# EasyEDA Pro project 51单片机串口开关V2.eprj

# Schematic Schematic1
Create Date: 2023-08-01; Page Name: P1; Project Name: 51单片机串口开关V2; Schematic Name: Schematic1; Update Date: 2023-11-14; Company: 嘉立创EDA; Page Size: A4; Version: V1.0
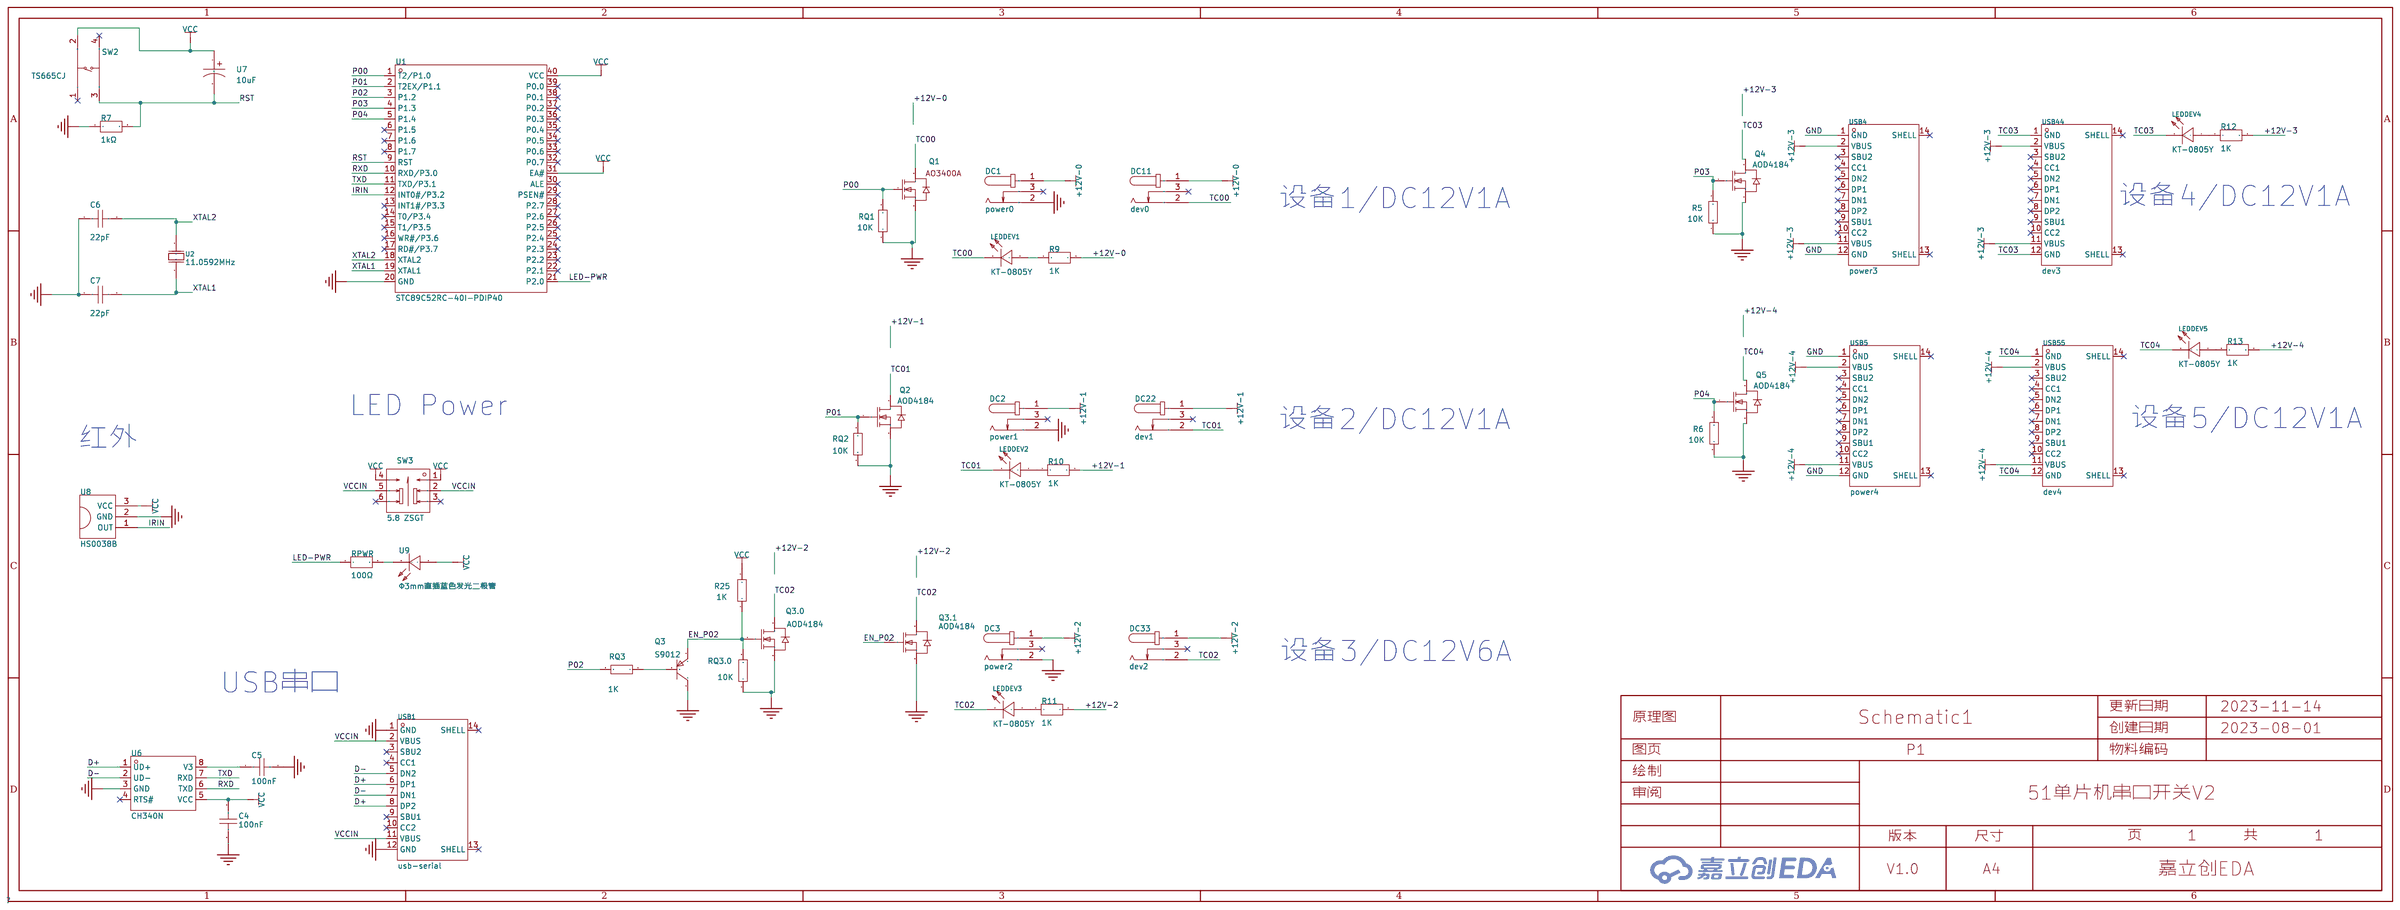
[diagram p0: schematic sheet]

## Parts
C4  100nF  [C0603]
C5  100nF  [C0603]
C6  22pF  [CAP-TH_L5.8-W2.4-P2.54-D0.6]
C7  22pF  [CAP-TH_L5.8-W2.4-P2.54-D0.6]
DC1  power0  [DC-IN-TH_DC-005-20A]
DC2  power1  [DC-IN-TH_DC-005-20A]
DC3  power2  [DC-IN-TH_DC-005-20A]
DC11  dev0  [DC-IN-TH_DC-005-20A]
DC22  dev1  [DC-IN-TH_DC-005-20A]
DC33  dev2  [DC-IN-TH_DC-005-20A]
LEDDEV1  KT-0805Y  [LED0805-R-RD]
LEDDEV2  KT-0805Y  [LED0805-R-RD]
LEDDEV3  KT-0805Y  [LED0805-R-RD]
LEDDEV4  KT-0805Y  [LED0805-R-RD]
LEDDEV5  KT-0805Y  [LED0805-R-RD]
Q1  AO3400A  [SOT-23-3_L2.9-W1.3-P1.90-LS2.4-BR]
Q2  AOD4184  [TO-252-2_L6.6-W6.1-P4.58-LS9.9-BR]
Q3  S9012  [TO-92-3_L4.6-W3.6-P1.27-L-1]
Q3.0  AOD4184  [TO-252-2_L6.6-W6.1-P4.58-LS9.9-BR]
Q3.1  AOD4184  [TO-252-2_L6.6-W6.1-P4.58-LS9.9-BR]
Q4  AOD4184  [TO-252-2_L6.6-W6.1-P4.58-LS9.9-BR]
Q5  AOD4184  [TO-252-2_L6.6-W6.1-P4.58-LS9.9-BR]
R5  10K  [R0603]
R6  10K  [R0603]
R7  1kΩ  [RES-TH_BD2.3-L6.5-P10.50-D0.5]
R9  1K  [RES-TH_BD2.3-L6.5-P10.50-D0.5]
R10  1K  [RES-TH_BD2.3-L6.5-P10.50-D0.5]
R11  1K  [RES-TH_BD2.3-L6.5-P10.50-D0.5]
R12  1K  [RES-TH_BD2.3-L6.5-P10.50-D0.5]
R13  1K  [RES-TH_BD2.3-L6.5-P10.50-D0.5]
R25  1K  [R0603]
RPWR  100Ω  [RES-TH_BD2.3-L6.5-P10.50-D0.5]
RQ1  10K  [R0603]
RQ2  10K  [R0603]
RQ3  1K  [R0603]
RQ3.0  10K  [R0603]
SW2  TS665CJ  [SW-TH_4P-L6.0-W6.0-P4.50-LS6.5]
SW3  5.8 ZSGT  [SW-TH_5.8ZSGT]
U1  STC89C52RC-40I-PDIP40  [DIP-40_L52.0-W13.7-P2.54-LS15.2-BL]
U2  11.0592MHz  [CRYSTAL-TH_L10.8-W4.5-P4.88]
U6  CH340N  [SOP-8_L4.9-W3.9-P1.27-LS6.0-BL]
U7  10uF  [CAP-TH_BD6.3-P2.50-D0.5-FD]
U8  HS0038B  [OPTO-TH_HS0038B-A]
U9  Φ3mm直插蓝色发光二极管  [LED-TH_BD4.1-P2.50-D0.5-FD_BULE]
USB1  usb-serial  [USB-C-SMD_TYPE-C-6PIN-2MD-073]
USB4  power3  [USB-C-SMD_TYPE-C-6PIN-2MD-073]
USB5  power4  [USB-C-SMD_TYPE-C-6PIN-2MD-073]
USB44  dev3  [USB-C-SMD_TYPE-C-6PIN-2MD-073]
USB55  dev4  [USB-C-SMD_TYPE-C-6PIN-2MD-073]

## Library data of the parts
C4 C5 = CAP_0603: Supplier Footprint: 0603
C6 C7 = CC1H220KA1EDCH4B1100: 容值:22pF;精度:±10%;额定电压:50V;温度系数:NP0;; LCSC Part Name: 22pF ±10% 50V; Supplier Part: C2832510; Manufacturer: Dersonic(德尔创); Supplier Footprint: 插件,P=2.54mm; JLCPCB Part Class: 扩展库; Datasheet: https://atta.szlcsc.com/upload/public/pdf/source/20211103/062C09467AB58979163D97626BAD0297.pdf; Supplier: LCSC; Tolerance: ±10%; Voltage Rated: 50V; Lead Spacing: 2.54mm; Temperature Coefficient: NP0; φD: 4.8mm; Body Thickness: 2.4mm
DC1-DC3 DC11 DC22 DC33 = DC-005-20A_C136744: 触点内径:2mm;触点外径:6.4mm;额定电流:500mA;额定电压:30V;; LCSC Part Name: DC-005-20A  内芯2.0mm 全铜; Supplier Part: C136744; Manufacturer: 韩国韩荣; Manufacturer Part: DC-005-20A; Supplier Footprint: 插件; JLCPCB Part Class: 扩展库; Datasheet: https://atta.szlcsc.com/upload/public/pdf/source/20210810/D1FE451D887B1804F0660F580C4AD849.pdf; Supplier: LCSC; Inside Contact Diameter: 2mm; Outside Contact Diameter: 6.4mm; Current Rating (Max): 500mA; Voltage Rating (Max): 30V
LEDDEV1-LEDDEV5 = KT-0805Y: 发光颜色:黄灯;二极管配置:-;透镜颜色:-;主波长:-;色温:-;功率:-;发光角度:-;安装方式:-;工作温度:-;; LCSC Part Name: 0805 黄灯 高亮; Supplier Part: C2296; Manufacturer: KENTO; Supplier Footprint: 0805; JLCPCB Part Class: 基础库; Datasheet: https://atta.szlcsc.com/upload/public/pdf/source/20160421/1461205044170.pdf; Supplier: LCSC; Emitted Color: 黄灯
Q1 = AO3400A_C347475: 类型:N沟道;漏源电压(Vdss):30V;连续漏极电流(Id):5.8A;功率(Pd):1.4W;导通电阻(RDS(on)@Vgs,Id):35mΩ@10V,5.8A;; LCSC Part Name: N沟道 30V 5.8A; Supplier Part: C347475; Manufacturer: UMW(广东友台半导体); Supplier Footprint: SOT-23; JLCPCB Part Class: 扩展库; Datasheet: https://atta.szlcsc.com/upload/public/pdf/source/20220429/98B7D6B2B83615ED4523A0C76368EB06.pdf; Supplier: LCSC; Type: N沟道; Drain Source Voltage (Vdss): 30V; Continuous Drain Current (Id): 5.8A; Power Dissipation (Pd): 1.4W; Drain Source On Resistance (RDS(on)@Vgs,Id): 35mΩ@10V,5.8A; Gate Threshold Voltage (Vgs(th)@Id): 1.4V@250uA; Total Gate Charge (Qg@Vgs): 12nC@4.5V; Input Capacitance (Ciss@Vds): 1.05nF@15V; Operating Temperature: -55℃~+150℃@(Tj)
Q2 Q3.0 Q3.1 Q4 Q5 = AOD4184: 类型:N沟道;漏源电压(Vdss):40V;连续漏极电流(Id):85A;功率(Pd):-;导通电阻(RDS(on)@Vgs,Id):5mΩ@10V,85A;阈值电压(Vgs(th)@Id):-;栅极电荷(Qg@Vgs):-;输入电容(Ciss@Vds):-;反向传输电容(Crss@Vds):-;; LCSC Part Name: N沟道 40V 85A; Supplier Part: C879026; Manufacturer: VBsemi(微碧); Supplier Footprint: TO-252; JLCPCB Part Class: 扩展库; Datasheet: https://atta.szlcsc.com/upload/public/pdf/source/20200930/C879026_1C5ED3CC2E280C7EDEB6515D52B7B7F3.pdf; Supplier: LCSC; Type: N沟道; Drain Source Voltage (Vdss): 40V; Continuous Drain Current (Id): 85A; Drain Source On Resistance (RDS(on)@Vgs,Id): 5mΩ@10V,85A
Q3 = S9012_C2931496: Supplier Part: C2931496; Manufacturer: JSMSEMI(杰盛微); Supplier Footprint: TO-92-3; JLCPCB Part Class: 扩展库; Datasheet: https://atta.szlcsc.com/upload/public/pdf/source/20211216/8B1045EB70E9342E1C247EF466AD93DE.pdf; Supplier: LCSC
R5 R6 R25 RQ1-RQ3 RQ3.0 = Res_0603: Supplier Footprint: 0603
R7 R9-R13 RPWR = MF1/4W-1KΩ±1%T52: 电阻类型:金属膜电阻;阻值:1kΩ;精度:±1%;功率:250mW;温度系数:±200ppm/℃;; LCSC Part Name: 1kΩ ±1% 250mW; Supplier Part: C713997; Manufacturer: 华星机电; Supplier Footprint: 轴向引线; JLCPCB Part Class: 扩展库; Datasheet: https://atta.szlcsc.com/upload/public/pdf/source/20200731/C713882_AE8EB1102749D7E4FB4FB13DC898C429.pdf; Supplier: LCSC; Type: 金属膜电阻; Tolerance: ±1%; Power(Watts): 250mW; Temperature Coefficient: ±200ppm/℃
SW2 = TS665CJ: 触点电流:50mA;额定电压(DC):12V;电路结构:单刀单掷;安装方式:直插;带灯:-;机械寿命:-;; LCSC Part Name: 6*6*5mm 直插 轻触开关; Supplier Part: C393938; Manufacturer: SHOU HAN(首韩); Supplier Footprint: 插件; JLCPCB Part Class: 扩展库; Datasheet: https://atta.szlcsc.com/upload/public/pdf/source/20190521/C393938_BDABEAC600B4C55E200A80AA129B70BC.pdf; Supplier: LCSC; Contact Current: 50mA; Voltage Rating (DC): 12V; Circuit: 单刀单掷; Mounting Style: 直插; Actuator Style: 圆形按钮; Switch Length: 6mm; Switch Width: 6mm; Switch Height: 5mm
SW3 = 5.8 ZSGT: 触点电流:110mA;额定电压 (DC):30V;绝缘电阻:100MΩ;电路结构:双刀双掷;安装方式:直插;自锁/无锁:自锁;按键形状:方形按钮;按键/盖帽颜色:白色;带灯:无;引脚样式:PC引脚;作用力:150gf@±50gf;工作温度:-10℃~+70℃;机械寿命:100000;; LCSC Part Name: 5.8*5.8有头/高头 带锁/自锁开关 泡泡机开关; Supplier Part: C2681587; Manufacturer: SHOU HAN(首韩); Supplier Footprint: 插件; Datasheet: https://atta.szlcsc.com/upload/public/pdf/source/20210107/C2681587_CDDDDA4A1C7AC9FEB01815B75893A6BA.pdf; Supplier: LCSC; Contact Current: 110mA; Voltage Rating (DC): 30V; Insulation Resistance: 100MΩ; Circuit: 双刀双掷; Mounting Style: 直插; Self Lock / No Lock: 自锁; Actuator Style: 方形按钮; Actuator/Cap Color: 白色; With Lamp: 无; Pin Style: PC引脚; Operating Force: 150gf@±50gf; Operating Temperature: -10℃~+70℃; Mechanical Life: 100000
U1 = STC89C52RC-40I-PDIP40: CPU内核:51系列;CPU最大主频:-;工作电压范围:3.3V~5.5V;内部振荡器:-;外部时钟频率范围:-;程序 FLASH容量:8KB;RAM总容量:512Byte;EEPROM/数据 FLASH容量:4KB;GPIO端口数量:35;ADC(单元数/通道数/位数):-;DAC(单元数/通道数/位数):-;(E)PWM(单元数/通道数/位数):-;8位Timer数量:-;16位Timer数量:3;32位Timer数量:-;内部比较器数量:-;U(S)ART路数:1;I2C路数:-;I2S路数:-;(; LCSC Part Name: 51系列 闪存：8KB RAM：512Byte; Supplier Part: C14022; Manufacturer: STC(宏晶); Supplier Footprint: DIP-40; JLCPCB Part Class: 扩展库; Datasheet: https://atta.szlcsc.com/upload/public/pdf/source/20210104/C14022_3E6032FDBB5DBC6F971AD019A8472F5B.pdf; Supplier: LCSC; CPU Core: 51系列; Supply Voltage Range: 3.3V~5.5V; Program FLASH Size: 8KB; RAM Size: 512Byte; EEPROM/Data FLASH Size: 4KB; GPIO Ports Number: 35; 16Bit Timer Number: 3; U(S)ART Number: 1; Peripherals / Functions / Protocol Stacks: 看门狗; Operating Temperature Range: -40℃~+85℃
U2 = ATS100B-E: 频率:10MHz;频率公差:±30ppm;负载电容:18pF;; LCSC Part Name: 10MHz ±30ppm 18pF; Supplier Part: C1669693; Manufacturer: CTS(西迪斯); Supplier Footprint: HC-49S; JLCPCB Part Class: 扩展库; Datasheet: https://atta.szlcsc.com/upload/public/pdf/source/20220124/B9986DAB42ECDE31CA8A9C6A4A6F535C.pdf; Supplier: LCSC; Frequency Tolerance: ±30ppm; Frequency Stability: ±50ppm; Load Capacitance: 18pF; Equivalent Series Resistance (ESR): 60Ω; Operating Temperature: -40℃~+85℃
U6 = CH340N: LCSC Part Name: USB转串口芯片 CH340; Supplier Part: C2977777; Manufacturer: WCH(南京沁恒); Supplier Footprint: SOP-8; Datasheet: https://atta.szlcsc.com/upload/public/pdf/source/20220223/82A45E4FF89B3EDCAD50B354450A7EF4.pdf; Supplier: LCSC
U7 = ESK106M1HD11RRSNP-R: 容值:10uF;精度:±20%;额定电压:50V;纹波电流:-;等效串联电阻:-;; LCSC Part Name: 10uF ±20% 50V; Supplier Part: C3015490; Manufacturer: MAN YUE(万裕科技); Supplier Footprint: 插件; JLCPCB Part Class: 扩展库; Datasheet: https://atta.szlcsc.com/upload/public/pdf/source/20190724/C406799_CDF11B2185D3B9C175922EABD678815E.pdf; Supplier: LCSC; Tolerance: ±20%; Rated Voltage: 50V; φD: 5mm; L: 11mm
U8 = HS0038B: Supplier Part: C9900001501; Supplier Footprint: DIP-3; JLCPCB Part Class: 扩展库; Datasheet: 2021-11-06/848019G/9d0c8d3ebb7f4498b21a2c16cf887121/HS0038B.pdf; Supplier: LCSC
U9 = Φ3mm直插蓝色发光二极管: Supplier Part: C9900011188; Supplier Footprint: LED-TH; JLCPCB Part Class: 扩展库; Datasheet: https://atta.szlcsc.comnull; Supplier: LCSC
USB1 USB4 USB5 USB44 USB55 = TYPE-C 16PIN 2MD(073): 连接器类型:Type-C;标准:-;公母:母座;触点数量:16;端口数量:1;安装方式:卧贴;额定电流 - 电源:5A;工作温度范围:-25℃~+85℃;; LCSC Part Name: TYPE-C母座 16P 4脚插件带定位柱 不锈钢外壳 2次模顶; Supplier Part: C2765186; Manufacturer: SHOU HAN(首韩); Supplier Footprint: SMD; Supplier: LCSC; Connector Type: Type-C; Gender: 母座; Number of Contacts: 16; Number of Ports: 1; Mounting Style: 卧贴; Current Rating - Power (Max): 5A; Operating Temperature Range: -25℃~+85℃

## Nets
+12V-0: DC1.1 DC11.1 R9.2
+12V-1: DC2.1 DC22.1 R10.2
+12V-2: DC3.1 DC33.1 R11.2
+12V-3: R12.2 USB4.2(VBUS) USB4.11(VBUS) USB44.2(VBUS) USB44.11(VBUS)
+12V-4: R13.2 USB5.2(VBUS) USB5.11(VBUS) USB55.2(VBUS) USB55.11(VBUS)
GND: C4.2 C5.2 C6.1 C7.1 DC1.2 DC2.2 DC3.2 Q1.2(S) Q2.3(S) Q3.3(C) Q3.0.3(S) Q3.1.3(S) Q5.3(S) R5.1 R6.1 R7.1 RQ1.1 RQ2.1 RQ3.0.1 U1.20(GND) U6.3(GND) U8.2(GND) USB1.1(GND) USB1.12(GND) USB4.1(GND) USB4.12(GND) USB5.1(GND) USB5.12(GND)
VCC: C4.1 R25.2 SW2.2(B) SW3.1 SW3.4 U1.31(EA#) U1.40(VCC) U6.5(VCC) U7.1 U8.3(VCC) U9.1(+)
VCCIN: SW3.2 SW3.5 USB1.2(VBUS) USB1.11(VBUS)
D+: U6.1(UD+) USB1.6(DP1) USB1.8(DP2)
D-: U6.2(UD-) USB1.5(DN2) USB1.7(DN1)
EN_P02: Q3.1(E) Q3.0.1(G) Q3.1.1(G) R25.1 RQ3.0.2
IRIN: U1.12(INT0#/P3.2) U8.1(OUT)
LED-PWR: RPWR.1 U1.21(P2.0)
P00: Q1.1(G) RQ1.2 U1.1(T2/P1.0)
P01: Q2.1(G) RQ2.2 U1.2(T2EX/P1.1)
P02: RQ3.2 U1.3(P1.2)
P03: Q4.1(G) R5.2 U1.4(P1.3)
P04: Q5.1(G) R6.2 U1.5(P1.4)
RST: R7.2 SW2.3(C) U1.9(RST) U7.2
RXD: U1.10(RXD/P3.0) U6.6(TXD)
TC00: DC11.2 LEDDEV1.2(-) Q1.3(D)
TC01: DC22.2 LEDDEV2.2(-) Q2.2(D)
TC02: DC33.2 LEDDEV3.2(-) Q3.0.2(D) Q3.1.2(D)
TC03: LEDDEV4.2(-) Q4.2(D) USB44.1(GND) USB44.12(GND)
TC04: LEDDEV5.2(-) Q5.2(D) USB55.1(GND) USB55.12(GND)
TXD: U1.11(TXD/P3.1) U6.7(RXD)
XTAL1: C7.2 U1.19(XTAL1) U2.2
XTAL2: C6.2 U1.18(XTAL2) U2.1
$1N2137: C5.1 U6.8(V3)
Net-(LEDDEV1-1): LEDDEV1.1(+) R9.1
Net-(LEDDEV2-1): LEDDEV2.1(+) R10.1
Net-(LEDDEV3-1): LEDDEV3.1(+) R11.1
Net-(LEDDEV4-1): LEDDEV4.1(+) R12.1
Net-(LEDDEV5-1): LEDDEV5.1(+) R13.1
Net-(Q3-2): Q3.2(B) RQ3.1
Net-(RPWR-2): RPWR.2 U9.2(-)

Not connected (* = marked no-connect by the designer): DC1 3*; DC2 3*; DC3 3*; DC11 3*; DC22 3*; DC33 3*; Q4 3(S); SW2 1(A)* 4(D)*; SW3 3* 6*; U1 6(P1.5)* 7(P1.6)* 8(P1.7)* 13(INT1#/P3.3)* 14(T0/P3.4)* 15(T1/P3.5)* 16(WR#/P3.6)* 17(RD#/P3.7)* 22(P2.1)* 23(P2.2)* 24(P2.3)* 25(P2.4)* 26(P2.5)* 27(P2.6)* 28(P2.7)* 29(PSEN#)* 30(ALE)* 32(P0.7)* 33(P0.6)* 34(P0.5)* 35(P0.4)* 36(P0.3)* 37(P0.2)* 38(P0.1)* 39(P0.0)*; U6 4(RTS#)*; USB1 3(SBU2)* 4(CC1)* 9(SBU1)* 10(CC2)* 13(SHELL)* 14(SHELL)*; USB4 3(SBU2)* 4(CC1)* 5(DN2)* 6(DP1)* 7(DN1)* 8(DP2)* 9(SBU1)* 10(CC2)* 13(SHELL)* 14(SHELL)*; USB5 3(SBU2)* 4(CC1)* 5(DN2)* 6(DP1)* 7(DN1)* 8(DP2)* 9(SBU1)* 10(CC2)* 13(SHELL)* 14(SHELL)*; USB44 3(SBU2)* 4(CC1)* 5(DN2)* 6(DP1)* 7(DN1)* 8(DP2)* 9(SBU1)* 10(CC2)* 13(SHELL)* 14(SHELL)*; USB55 3(SBU2)* 4(CC1)* 5(DN2)* 6(DP1)* 7(DN1)* 8(DP2)* 9(SBU1)* 10(CC2)* 13(SHELL)* 14(SHELL)*

## Notes on the sheet
- 设备1/DC12V1A
- 设备4/DC12V1A
- LED Power
- 设备2/DC12V1A
- 设备5/DC12V1A
- 红外
- 设备3/DC12V6A
- USB串口

# Schematic Schematic2
Create Date: 2023-11-14; Page Name: P1; Project Name: 51单片机串口开关V2; Schematic Name: Schematic2; Update Date: 2023-11-14; Company: 嘉立创EDA; Page Size: A4; Version: V1.0
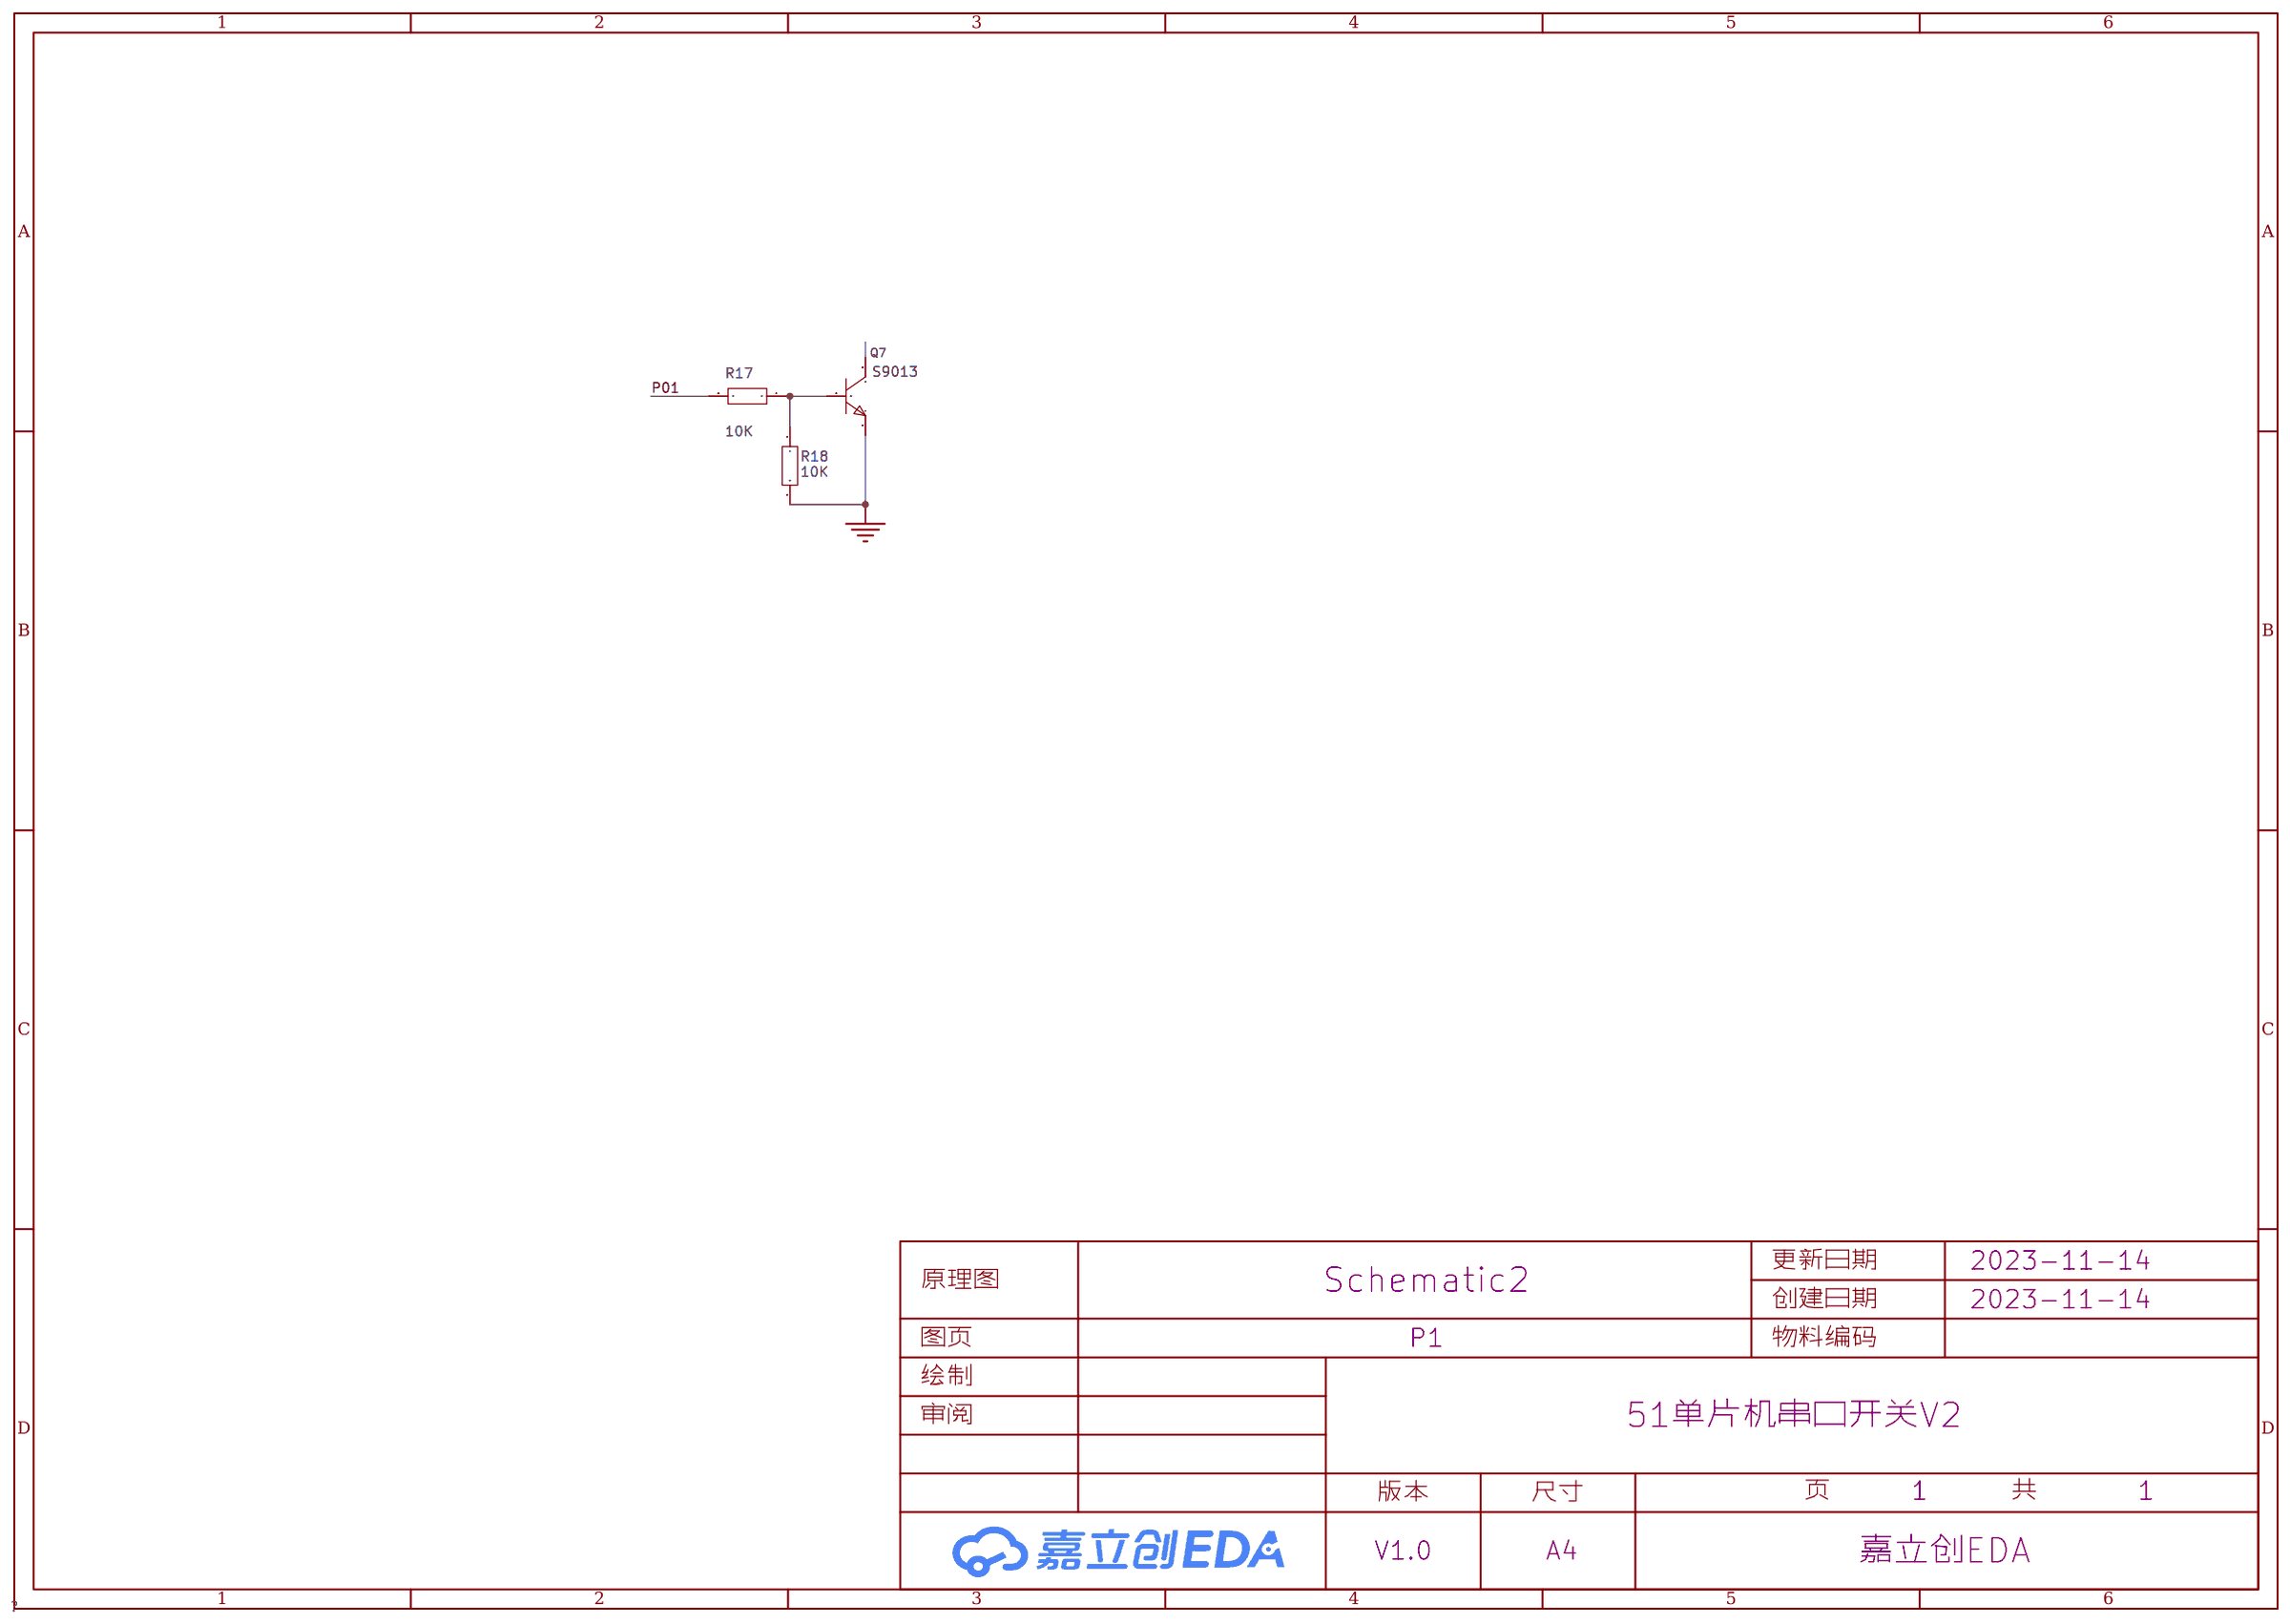
[diagram p1: schematic sheet]

## Parts
Q7  S9013  [TO-92-3_L4.9-W3.7-P1.27-L]
R17  10K  [R0603]
R18  10K  [R0603]

## Library data of the parts
Q7 = S9013_C6748: 晶体管类型:NPN;集射极击穿电压(Vceo):25V;集电极电流(Ic):500mA;功率(Pd):625mW;集电极截止电流(Icbo):100nA;集电极-发射极饱和电压(VCE(sat)@Ic,Ib):600mV@500mA,50mA;直流电流增益(hFE@Ic,Vce):190@50mA,1V;特征频率(fT):150MHz;工作温度:+150℃@(Tj);; LCSC Part Name: NPN 25V 500mA (190-300); Supplier Part: C6748; Manufacturer: CJ(江苏长电/长晶); Supplier Footprint: TO-92-3; JLCPCB Part Class: 扩展库; Supplier: LCSC; Transistor Type: NPN; Collector-Emitter Breakdown Voltage (Vceo): 25V; Collector Current (Ic): 500mA; Power Dissipation (Pd): 625mW; Collector Cut-Off Current (Icbo): 100nA; Collector-Emitter Saturation Voltage (VCE(sat)@Ic,Ib): 600mV@500mA,50mA; DC Current Gain (hFE@Ic,Vce): 190@50mA,1V; Transition Frequency (fT): 150MHz; Operating Temperature: +150℃@(Tj)
R17 R18 = Res_0603: Supplier Footprint: 0603

## Nets
GND: Q7.1(E) R18.2
P01: R17.2
Net-(Q7-2): Q7.2(B) R17.1 R18.1

Not connected (* = marked no-connect by the designer): Q7 3(C)

# Board PCB1
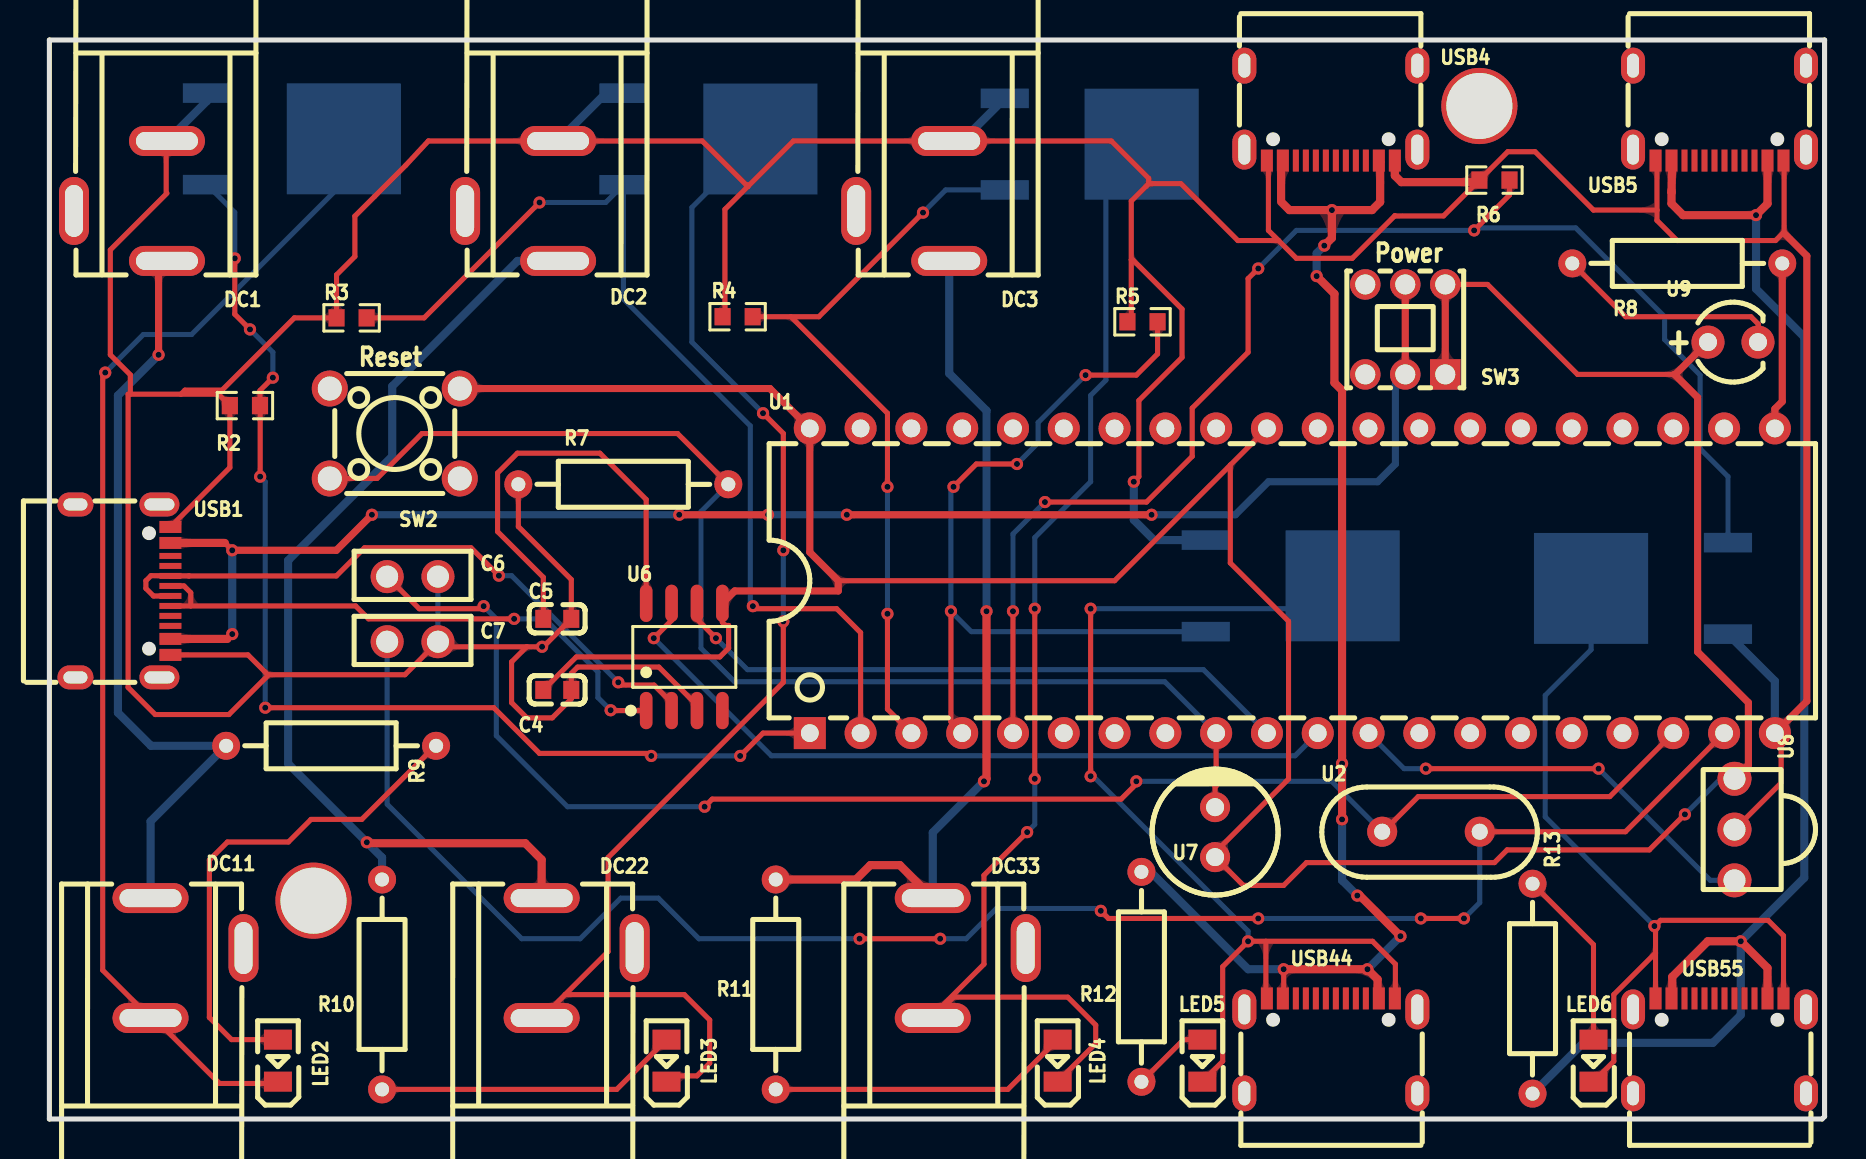
[diagram p2: board, top side]
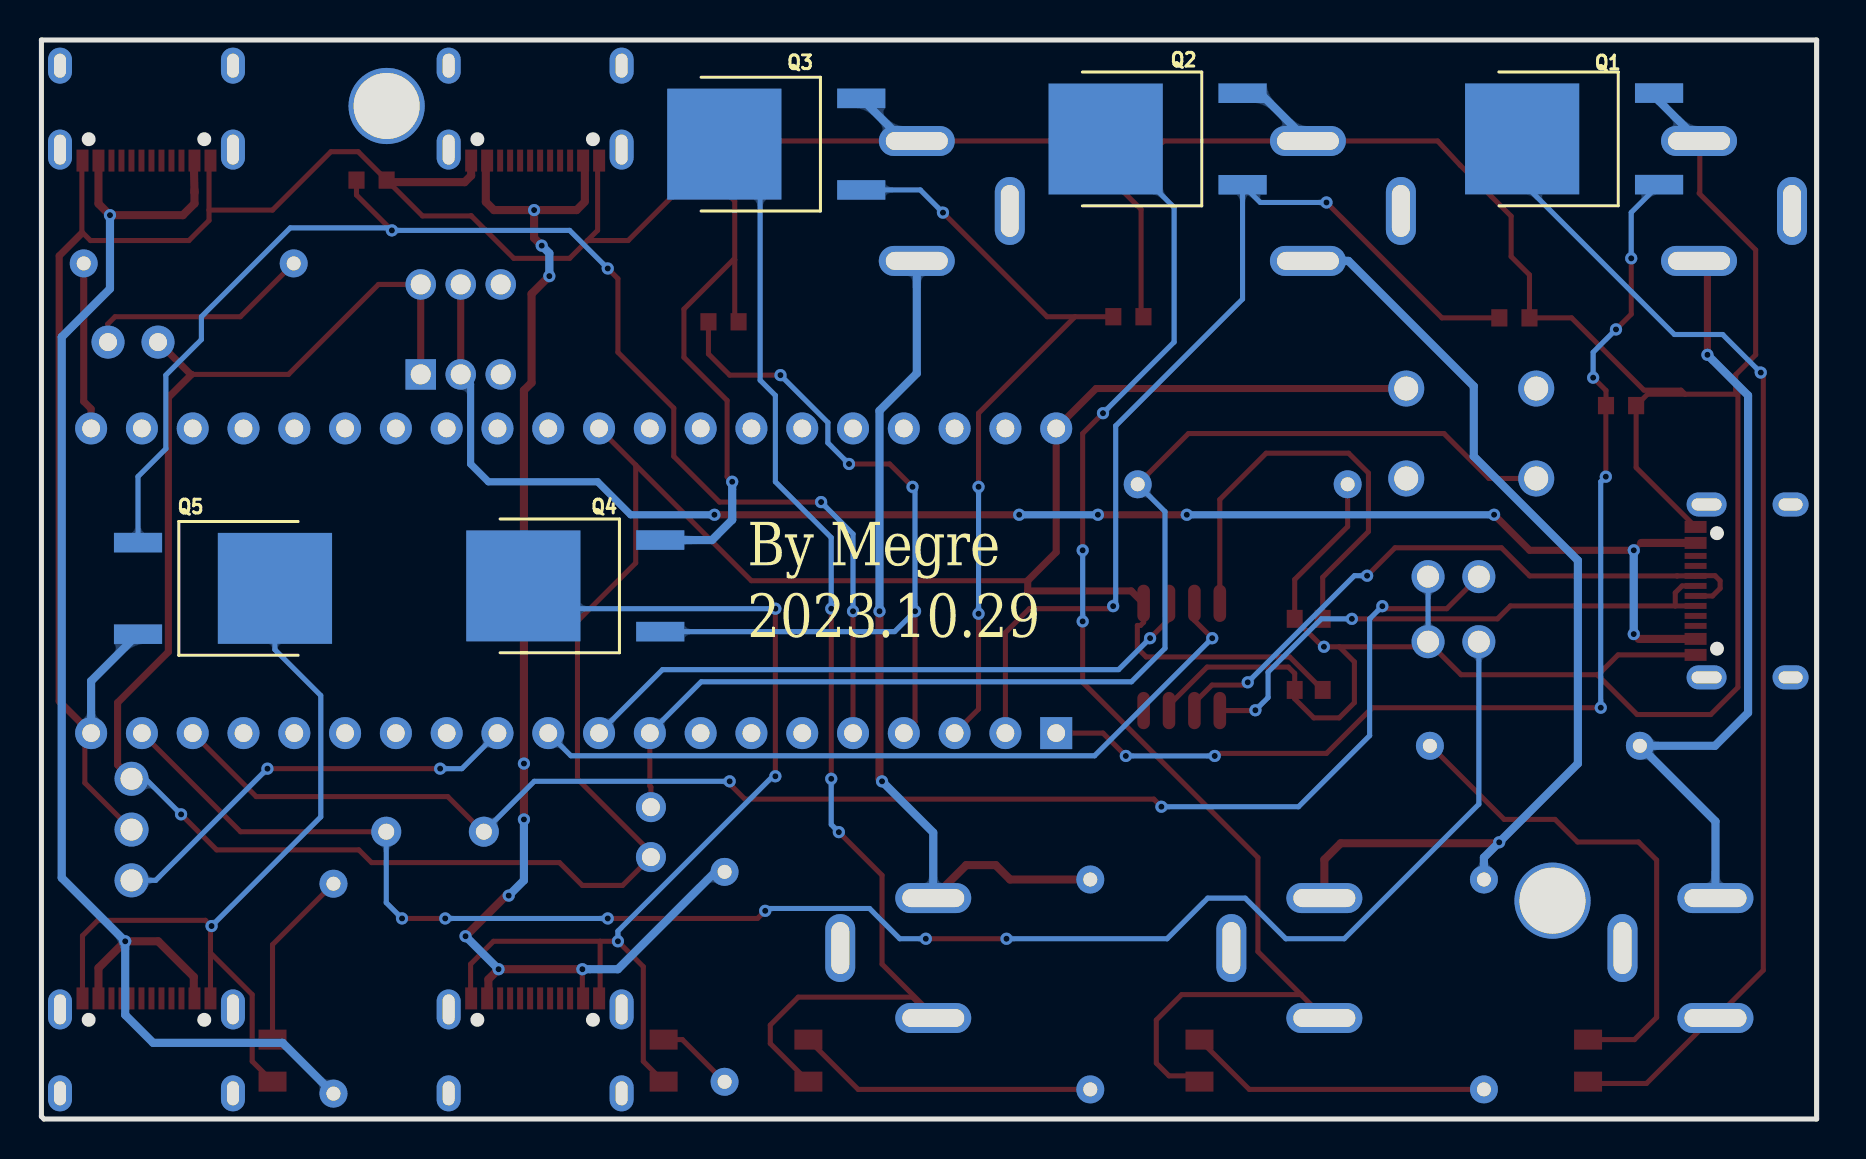
[diagram p3: board, bottom side, seen from below]

Outline 88.77 x 53.98 mm; copper layers: Top Layer, Bottom Layer. Coordinates in mm from the lower left corner of the outline.
Outline path: 0,53.98 88.77,53.98 88.77,0.13 88.65,0 0,0 0,53.98
Stack: Top Layer 0.035mm / Dielectric1 1.51mm FR4 er 4.5 / Bottom Layer 0.035mm

## Design rules (mm)
template: JLCPCB Capability(Two Layers Board)
spacing copperThickness1oz (default): track to track 0.102, other pairs 0.152 to 0.3
spacing copperThickness2oz: track to track 0.203, other pairs 0.152 to 0.3
track width copperThickness1oz (default): min 0.127, default 0.254, max 2.54
track width copperThickness2oz: min 0.203, default 0.254, max 2.54
differential pair differentialPair (default): width min 0.127, default 0.254, max 2.54; gap min 0.152, default 0.152
via viaSize (default): diameter min 0.5, default 0.61, max 10; hole min 0.3, default 0.305, max 6.3

## Placement (name value [footprint] x y rotation side)
C4  100nF  [C0603]  25.4 21.46 0 top
C5  100nF  [C0603]  25.4 25.02 0 top
C6  22pF  [CAP-TH_L5.8-W2.4-P2.54-D0.6]  18.16 27.13 180 top
C7  22pF  [CAP-TH_L5.8-W2.4-P2.54-D0.6]  18.16 23.88 180 top
DC1  power0  [DC-IN-TH_DC-005-20A]  3.56 45.92 270 top
DC2  power1  [DC-IN-TH_DC-005-20A]  23.11 45.92 270 top
DC3  power2  [DC-IN-TH_DC-005-20A]  42.67 45.92 270 top
DC11  dev0  [DC-IN-TH_DC-005-20A]  7.38 8.05 90 top
DC22  dev1  [DC-IN-TH_DC-005-20A]  26.94 8.05 90 top
DC33  dev2  [DC-IN-TH_DC-005-20A]  46.5 8.05 90 top
LED2  KT-0805Y  [LED0805-R-RD]  11.43 2.92 90 top
LED3  KT-0805Y  [LED0805-R-RD]  30.86 2.92 90 top
LED4  KT-0805Y  [LED0805-R-RD]  50.42 2.92 90 top
LED5  KT-0805Y  [LED0805-R-RD]  57.66 2.92 90 top
LED6  KT-0805Y  [LED0805-R-RD]  77.22 2.92 90 top
NOREF  -  [Pad_e17232]  13.21 10.92 0 top
NOREF#2  -  [Pad_e17230]  71.51 50.67 0 top
Q1  AO3400A  [TO-252-2_L6.6-W6.1-P4.58-LS9.9-BR]  11.3 49.03 180 bottom
Q2  AOD4184  [TO-252-2_L6.6-W6.1-P4.58-LS9.9-BR]  32.13 49.02 180 bottom
Q3  S9012  [TO-252-2_L6.6-W6.1-P4.58-LS9.9-BR]  51.2 48.76 180 bottom
Q4  AOD4184  [TO-252-2_L6.6-W6.1-P4.58-LS9.9-BR]  61.25 26.67 180 bottom
Q5  AOD4184  [TO-252-2_L6.6-W6.1-P4.58-LS9.9-BR]  80.52 26.54 0 bottom
R2  10K  [R0603]  9.78 35.69 0 top
R3  10K  [R0603]  15.11 40.08 0 top
R4  10K  [R0603]  34.42 40.13 0 top
R5  10K  [R0603]  54.66 39.88 0 top
R6  10K  [R0603]  72.26 46.97 0 top
R7  1kΩ  [RES-TH_BD2.3-L6.5-P10.50-D0.5]  28.7 31.75 0 top
R8  100Ω  [RES-TH_BD2.3-L6.5-P10.50-D0.5]  81.41 42.8 180 top
R9  1K  [RES-TH_BD2.3-L6.5-P10.50-D0.5]  14.09 18.67 180 top
R10  1K  [RES-TH_BD2.3-L6.5-P10.50-D0.5]  16.64 6.73 90 top
R11  1K  [RES-TH_BD2.3-L6.5-P10.50-D0.5]  36.32 6.73 90 top
R12  1K  [RES-TH_BD2.3-L6.5-P10.50-D0.5]  54.61 7.11 90 top
R13  1K  [RES-TH_BD2.3-L6.5-P10.50-D0.5]  74.17 6.52 270 top
SW2  TS665CJ  [SW-TH_4P-L6.0-W6.0-P4.50-LS6.5]  17.27 34.29 0 top
SW3  5.8 ZSGT  [SW-TH_5.8ZSGT]  67.8 39.5 0 top
U1  STC89C52RC-40I-PDIP40  [DIP-40_L52.0-W13.7-P2.54-LS15.2-BL]  62.16 26.92 0 top
U2  11.0592MHz  [CRYSTAL-TH_L10.8-W4.5-P4.88]  69.09 14.37 0 top
U6  CH340N  [SOP-8_L4.9-W3.9-P1.27-LS6.0-BL]  31.75 23.11 0 top
U7  10uF  [CAP-TH_BD6.3-P2.50-D0.5-FD]  58.29 14.35 90 top
U8  HS0038B  [OPTO-TH_HS0038B-A]  84.27 14.48 270 top
U9  Φ3mm直插蓝色发光二极管  [LED-TH_BD4.1-P2.50-D0.5-FD_BULE]  84.19 38.86 0 top
USB1  usb-serial  [USB-C-SMD_TYPE-C-6PIN-2MD-073]  3.68 26.42 270 top
USB4  power3  [USB-C-SMD_TYPE-C-6PIN-2MD-073]  64.08 50.32 180 top
USB5  power4  [USB-C-SMD_TYPE-C-6PIN-2MD-073]  83.52 50.32 180 top
USB44  dev3  [USB-C-SMD_TYPE-C-6PIN-2MD-073]  64.08 3.66 0 top
USB55  dev4  [USB-C-SMD_TYPE-C-6PIN-2MD-073]  83.52 3.66 0 top

## Footprints (pads in the part's own frame, mm; a bottom-side part is the same pattern mirrored in y, then rotated)
C0603
  rect 0.8x0.9 smd: 1(-0.7,0) 2(0.7,0)
CAP-TH_BD6.3-P2.50-D0.5-FD
  round 1.5 hole 0.9: 1(-1.25,0) 2(1.25,0)
CAP-TH_L5.8-W2.4-P2.54-D0.6
  round 1.65 hole 1.1: 1(-1.27,0) 2(1.27,0)
CRYSTAL-TH_L10.8-W4.5-P4.88
  round 1.5 hole 0.8: 1(-2.44,0) 2(2.44,0)
DC-IN-TH_DC-005-20A
  oval 1.5x3.8 hole 0.9x3.1: 1(3,2.325) 2(-3,2.325)
  oval 3.4x1.5 hole 2.6x0.9: 3(0.5,-2.325)
DIP-40_L52.0-W13.7-P2.54-LS15.2-BL
  rect 1.6x1.6 hole 0.889: 1(-24.13,-7.62)
  round 1.6 hole 0.889: 2(-21.59,-7.62) 3(-19.05,-7.62) 4(-16.51,-7.62) 5(-13.97,-7.62) 6(-11.43,-7.62) 7(-8.89,-7.62) 8(-6.35,-7.62) 9(-3.81,-7.62) 10(-1.27,-7.62) 11(1.27,-7.62) 12(3.81,-7.62) 13(6.35,-7.62) 14(8.89,-7.62) 15(11.43,-7.62) 16(13.97,-7.62) 17(16.51,-7.62) 18(19.05,-7.62) 19(21.59,-7.62) 20(24.13,-7.62) 21(24.13,7.62) 22(21.59,7.62) 23(19.05,7.62) 24(16.51,7.62) 25(13.97,7.62) 26(11.43,7.62) 27(8.89,7.62) 28(6.35,7.62) 29(3.81,7.62) 30(1.27,7.62) 31(-1.27,7.62) 32(-3.81,7.62) 33(-6.35,7.62) 34(-8.89,7.62) 35(-11.43,7.62) 36(-13.97,7.62) 37(-16.51,7.62) 38(-19.05,7.62) 39(-21.59,7.62) 40(-24.13,7.62)
LED0805-R-RD
  rect 1x1.399 smd: 1(1.05,0) 2(-1.05,0)
LED-TH_BD4.1-P2.50-D0.5-FD_BULE
  round 1.651 hole 0.9: 1(-1.25,0) 2(1.25,0)
OPTO-TH_HS0038B-A
  round 1.7 hole 1.1: 1(2.54,0) 2(0,0) 3(-2.54,0)
Pad_e17230
  round 3.81 hole 3.302: 41(0,0)
Pad_e17232
  round 3.81 hole 3.302: 41(0,0)
R0603
  rect 0.806x0.864 smd: 1(-0.753,0) 2(0.753,0)
RES-TH_BD2.3-L6.5-P10.50-D0.5
  round 1.4 hole 0.7: 1(-5.25,0) 2(5.25,0)
SOP-8_L4.9-W3.9-P1.27-LS6.0-BL
  oval 0.63x1.865 smd: 1(-1.905,-2.683) 2(-0.635,-2.683) 3(0.635,-2.683) 4(1.905,-2.683) 5(1.905,2.683) 6(0.635,2.683) 7(-0.635,2.683) 8(-1.905,2.683)
SW-TH_4P-L6.0-W6.0-P4.50-LS6.5
  round 1.8 hole 1.2: 1(-3.25,2.25) 2(3.25,2.25) 3(-3.25,-2.25) 4(3.25,-2.25)
SW-TH_5.8ZSGT
  rect 1.524x1.524 hole 1: 1(2,-2.25)
  round 1.524 hole 1: 2(0,-2.25) 3(-2,-2.25) 4(2,2.25) 5(0,2.25) 6(-2,2.25)
TO-252-2_L6.6-W6.1-P4.58-LS9.9-BR
  rect 2.409x0.979 smd: 1(3.424,-2.29) 3(3.424,2.29)
  rect 5.711x5.548 smd: 2(-3.424,0)
USB-C-SMD_TYPE-C-6PIN-2MD-073
  rect 0.6x1.1 smd: 1(-3.2,2.375) 2(-2.4,2.375) 11(2.4,2.375) 12(3.2,2.375)
  rect 0.3x1.1 smd: 3(-1.75,2.375) 4(-1.25,2.375) 5(-0.75,2.375) 6(-0.25,2.375) 7(0.25,2.375) 8(0.75,2.375) 9(1.25,2.375) 10(1.75,2.375)
  oval 1.2x2 hole 0.6x1.5: 13(-4.325,1.825) 14(4.325,1.825)
  oval 1.2x1.8 hole 0.6x1.2: 13(-4.325,-2.375) 14(4.325,-2.375)

## Nets
+12V-0: DC1.1 DC11.1 R9.2
+12V-1: DC2.1 DC22.1 R10.2
+12V-2: DC3.1 DC33.1 R11.2
+12V-3: R12.2 USB4.2 USB4.11 USB44.2 USB44.11
+12V-4: R13.2 USB5.2 USB5.11 USB55.2 USB55.11
GND: C4.2 C5.2 C6.1 C7.1 DC1.2 DC2.2 DC3.2 Q1.3 Q2.3 Q3.3 Q4.3 Q5.3 R2.1 R3.1 R4.1 R5.1 R6.1 R7.1 U1.20 U6.3 U8.2 USB1.1 USB1.12 USB4.1 USB4.12 USB5.1 USB5.12
VCC: C4.1 SW2.2 SW3.1 SW3.4 U1.31 U1.40 U6.5 U7.1 U8.3 U9.1
VCCIN: SW3.2 SW3.5 USB1.2 USB1.11
D+: U6.1 USB1.6 USB1.8
D-: U6.2 USB1.5 USB1.7
IRIN: U1.12 U8.1
LED-PWR: R8.1 U1.21
P00: Q1.1 R2.2 U1.1
P01: Q2.1 R3.2 U1.2
P02: Q3.1 R4.2 U1.3
P03: Q4.1 R5.2 U1.4
P04: Q5.1 R6.2 U1.5
RST: R7.2 SW2.3 U1.9 U7.2
RXD: U1.10 U6.6
TC00: DC11.2 LED2.2 Q1.2
TC01: DC22.2 LED3.2 Q2.2
TC02: DC33.2 LED4.2 Q3.2
TC03: LED5.2 Q4.2 USB44.1 USB44.12
TC04: LED6.2 Q5.2 USB55.1 USB55.12
TXD: U1.11 U6.7
XTAL1: C7.2 U1.19 U2.2
XTAL2: C6.2 U1.18 U2.1
$1N2137: C5.1 U6.8
$1N11558: R8.2 U9.2
$1N11682: LED2.1 R9.1
$1N12284: LED3.1 R10.1
$1N12327: LED4.1 R11.1
$1N12370: LED5.1 R12.1
$1N12592: LED6.1 R13.1

Pads without a net: DC1 3; DC2 3; DC3 3; DC11 3; DC22 3; DC33 3; NOREF 41; NOREF#2 41; SW2 1 4; SW3 3 6; U1 6 7 8 13 14 15 16 17 22 23 24 25 26 27 28 29 30 32 33 34 35 36 37 38 39; U6 4; USB1 3 4 9 10 13 14; USB4 3 4 5 6 7 8 9 10 13 14; USB5 3 4 5 6 7 8 9 10 13 14; USB44 3 4 5 6 7 8 9 10 13 14; USB55 3 4 5 6 7 8 9 10 13 14

## Via types
v1: diameter 0.61, hole 0.305, Top Layer to Bottom Layer, 73 vias

## Routing (per net, layer and track width the routed paths; a pad name or vN(x,y) marks a point on that pad's centre or on a via; arc(x,y) is an arc through that point)
+12V-0: length 38.9
  Top Layer w0.355: v1(5.46,38.23) 5.46,42.5 DC1.1
  Bottom Layer w0.406: DC11.1 5.06,14.89 R9.2 5.08,18.67 3.43,20.32 3.43,36.2 v1(5.46,38.23)
+12V-1: length 50.7
  Top Layer w0.406: 24.62,11.05 24.62,12.98 23.8,13.8 15.92,13.8 v1(15.88,13.84)
  Bottom Layer w0.406: R10.2 16.64,13.08 v1(15.88,13.84) 11.94,17.78 11.94,27.94 17.14,33.15 17.14,36.66 23.41,42.92 25.44,42.92
+12V-2: length 42.6
  Top Layer w0.406: DC33.1 42.53,12.7 41.05,12.7 40.33,11.98 R11.2 ; v1(46.86,25.4) 46.86,17.02 v1(46.74,16.89)
  Bottom Layer w0.406: v1(46.86,25.4) 46.86,35.43 45,37.3 DC3.1 ; v1(46.74,16.89) 44.18,14.33 DC33.1
+12V-3: length 66.7
  Top Layer w0.254: USB44.2 61.72,6.07 v1(61.72,7.49)
  Top Layer w0.406: v1(63.75,43.69) 64.14,44.07 v1(64.14,45.47) ; 61.6,45.97 61.6,47.85 USB4.11 ; v1(64.14,45.47) 66.14,45.47 66.55,45.87 66.55,47.88 66.48,47.94 ; v1(64.14,45.47) 62.01,45.47 61.6,45.88 ; v1(61.72,7.49) v1(65.91,7.49) 66.42,6.98 66.42,6.09 66.48,6.03 ; v1(65.4,11.18) 65.53,11.18 v1(67.56,9.14) ; v1(64.64,14.99) v1(64.64,17.78) 64.64,36.45 64.26,36.83 64.26,41.28 v1(63.37,42.16)
  Bottom Layer w0.406: R12.2 55.08,12.36 59.94,7.49 v1(61.72,7.49) ; v1(63.75,43.69) 63.37,43.31 v1(63.37,42.16) ; v1(65.4,11.18) 64.64,11.94 v1(64.64,14.99) ; v1(67.56,9.14) v1(65.91,7.49)
+12V-4: length 72.7
  Top Layer w0.406: 81.12,46.36 81.15,47.91 USB5.11 ; 81.12,46.36 81.12,46.47 ; 81.12,46.36 81.12,45.79 81.7,45.21 v1(85.34,45.21) 85.92,45.79 USB5.2 ; USB55.11 85.92,7.55 v1(84.58,8.89) 82.93,8.89 81.15,7.11 81.15,6.07 USB55.2
  Bottom Layer w0.406: R13.2 76.71,3.81 83.18,3.81 84.58,5.21 v1(84.58,8.89) 87.76,12.06 87.76,39.12 85.34,41.53 v1(85.34,45.21)
GND: length 293.3
  Top Layer w0.254: 4.05,36.26 4.05,37.23 3.05,38.23 3.05,43.47 5.88,46.31 ; U8.2 86.6,16.81 86.6,18.99 U1.20 ; USB1.12 9.93,23.22 10.92,22.23 ; 23.87,23.62 23.11,22.87 23.11,20.83 23.88,20.07 25.15,20.07 26.1,21.02 C4.2 26.1,22.29 26.42,22.61 30.48,22.61 32.39,20.7 32.39,20.43 ; 23.87,23.62 19.69,23.62 C7.1 17.78,22.23 10.97,22.23 8.98,20.23 5.3,20.23 3.94,21.59 3.94,36.26 6.58,36.26 ; 23.87,23.62 v1(24.64,23.62) 24.7,23.62 C5.2 26.1,26.99 23.45,29.63 R7.1 ; 60.88,47.94 60.96,47.87 60.96,44.45 61.47,43.94 ; 34.92,46.65 33.78,45.5 33.78,40.25 R4.1 ; 34.92,46.65 32.65,48.92 18.95,48.92 17.82,47.71 16.28,46.16 15.28,45.16 15.28,43.14 14.36,42.23 R3.1 12.25,40.08 8.63,36.46 6.78,36.46 6.58,36.26 ; 34.92,46.65 34.93,46.64 37.21,48.92 53.1,48.92 54.98,47.05 54.98,46.79 ; 34.92,46.65 34.92,46.74 ; 6.58,36.26 8.46,36.26 R2.1 9.03,32.59 USB1.1 ; USB5.1 86.75,47.91 86.75,44.31 ; 54.98,46.79 54.1,45.92 54.1,42.98 ; 54.98,46.79 56.58,46.79 59.43,43.94 61.47,43.94 ; v1(54.23,31.88) 54.48,32.13 54.48,35.94 56.64,38.1 56.64,40.51 54.17,42.98 54.1,42.98 ; 61.47,43.94 62.36,43.05 65.15,43.05 67.28,45.19 67.28,45.17 69.72,45.17 71.41,46.86 ; 54.1,42.98 54.1,40.07 R5.1 ; 5.88,48.92 5.84,48.88 5.84,46.36 ; 86.72,44.34 86.32,43.94 81.4,43.94 80.39,44.95 80.39,45.47 ; R6.1 72.93,48.39 74.29,48.39 77.22,45.47 80.39,45.47 ; USB5.12 80.39,47.87 80.39,45.47
  Top Layer w0.355: U1.20 87.88,20.9 87.88,43.18 86.75,44.31
  Top Layer w0.406: USB4.1 67.28,47.19 67.61,46.86 71.41,46.86 R6.1
  Bottom Layer w0.254: C6.1 C7.1
  Bottom Layer w0.406: 5.88,48.92 7.88,50.92 Q1.3 ; Q3.3 45.64,48.92 45,48.92 ; 25.44,48.92 27.83,51.31 Q2.3 ; Q4.3 55.24,28.96 54.23,29.97 v1(54.23,31.88) ; U1.20 86.29,21.91 Q5.3
VCC: length 163.6
  Top Layer w0.254: 81.27,37.25 76.42,37.25 71.92,41.75 SW3.4 ; U1.31 59.05,32.71 ; 59.05,32.71 59.05,27.81 61.97,24.9 61.97,17.01 58.29,13.34 U7.1 59.71,11.68 61.72,11.68 62.86,12.83 72.26,12.83 72.9,13.46 80.01,13.46 v1(81.79,15.24) ; 59.05,32.71 53.27,26.93 39.45,26.93 ; U6.5 33.65,24.84 33.81,24.69 33.97,24.69 33.97,23.55 33.53,23.11 26.35,23.11 C4.1
  Top Layer w0.355: U8.3 84.96,17.72 84.96,20.83 82.42,23.37 82.42,36.09 81.27,37.25 81.31,37.25 82.92,38.86 ; U6.5 34.27,26.42 39.45,26.42 39.45,26.93 38.03,28.35 U1.40 36.03,36.54 SW2.2 ; SW3.4 SW3.1
  Bottom Layer w0.254: U8.3 83.57,17.02 v1(81.79,15.24)
VCCIN: length 79.4
  Top Layer w0.254: 8.78,28.82 v1(9.14,28.45)
  Top Layer w0.355: v1(35.94,30.23) v1(31.5,30.23) ; v1(9.14,28.45) 14.35,28.45 v1(16.13,30.23) ; SW3.5 SW3.2 ; v1(55.12,30.23) v1(39.88,30.23)
  Top Layer w0.406: 8.9,24.02 USB1.11 ; 8.78,28.82 USB1.2
  Bottom Layer w0.355: v1(31.5,30.23) v1(16.13,30.23) ; v1(55.12,30.23) 59.31,30.23 60.96,31.88 66.42,31.88 67.31,32.77 67.31,36.75 SW3.2 ; v1(39.88,30.23) v1(35.94,30.23)
  Bottom Layer w0.406: v1(9.14,24.26) v1(9.14,28.45)
D+: length 28.5
  Top Layer w0.254: v1(28.07,20.45) 28.08,20.43 U6.1 ; v1(23.24,25.02) 15.96,25.02 15.31,25.67 7.07,25.67 ; 7.07,25.67 7.07,26.33 6.73,26.67 USB1.6 ; 7.07,25.67 USB1.8
  Bottom Layer w0.254: v1(28.07,20.45) 27.43,21.08 27.43,22.36 24.77,25.02 v1(23.24,25.02)
D-: length 32.3
  Top Layer w0.254: v1(22.48,27.18) 21.08,28.58 15.76,28.58 14.35,27.17 6.98,27.17 ; USB1.5 6.06,27.18 6.98,27.17 ; U6.2 31.11,20.83 30.24,21.71 28.59,21.71 v1(28.45,21.84) ; USB1.7 6.05,26.16 5.21,26.16 4.83,26.54 4.83,26.92 5.08,27.18 5.97,27.18 ; 6.98,27.17 6.96,27.17
  Bottom Layer w0.254: v1(28.45,21.84) 23.11,27.18 v1(22.48,27.18)
IRIN: length 21.4
  Top Layer w0.254: v1(77.47,17.53) v1(68.83,17.53)
  Bottom Layer w0.254: U1.12 67.74,17.53 v1(68.83,17.53) ; U8.1 83.06,11.94 v1(77.47,17.53)
LED-PWR: length 8.4
  Top Layer w0.355: U1.21 86.29,35.52 86.66,35.89 R8.1
P00: length 56.6
  Top Layer w0.254: v1(10.54,32.13) 10.54,35.68 R2.2 10.53,36.44 v1(11.18,37.08) ; U1.1 35.69,19.3 v1(34.54,18.16) ; v1(10.8,20.57) 22.22,20.57 24.51,18.29 29.97,18.29 v1(30.1,18.16) ; v1(10.03,39.5) 9.27,40.26 v1(9.27,43.05)
  Bottom Layer w0.254: v1(34.54,18.16) v1(30.1,18.16) ; Q1.1 9.27,45.35 v1(9.27,43.05) ; v1(10.54,32.13) 10.8,31.88 v1(10.8,20.57) ; v1(10.03,39.5) 11.18,38.35 v1(11.18,37.08)
P01: length 50.3
  Top Layer w0.254: v1(24.51,45.85) 18.74,40.08 R3.2 ; U1.2 40.57,24.33 39.37,25.53 35.31,25.53 v1(35.18,25.65)
  Bottom Layer w0.254: v1(24.51,45.85) 27.82,45.85 Q2.1 28.71,41.02 35.05,34.67 35.05,25.78 v1(35.18,25.65)
P02: length 38.6
  Top Layer w0.254: R4.2 37.08,40.13 ; 37.08,40.13 41.91,35.31 v1(41.91,31.62) ; 37.08,40.13 38.48,40.13 v1(43.69,45.34) ; v1(41.91,25.27) 41.91,20.5 U1.3
  Bottom Layer w0.254: v1(43.69,45.34) 44.82,46.47 Q3.1 ; v1(41.91,31.62) v1(41.91,25.27)
P03: length 40.9
  Top Layer w0.254: v1(45.21,31.62) 46.36,32.77 v1(48.39,32.77) ; v1(51.82,37.21) 54.36,37.21 55.42,38.27 R5.2 ; U1.4 45.08,19.87 v1(45.08,25.4)
  Bottom Layer w0.254: v1(45.21,31.62) 45.08,31.5 v1(45.08,25.4) 46.11,24.38 Q4.1 ; v1(51.82,37.21) 49.44,34.84 49.44,33.82 v1(48.39,32.77)
P04: length 70.2
  Top Layer w0.254: v1(71.25,44.45) 73.02,46.22 R6.2 ; v1(49.78,30.86) 54.86,30.86 57.15,33.15 57.15,35.56 59.94,38.35 59.94,42.04 v1(60.45,42.55) ; U1.5 v1(48.19,25.4)
  Bottom Layer w0.254: v1(49.78,30.86) 48.19,29.26 v1(48.19,25.4) ; v1(60.45,42.55) 62.36,44.45 v1(71.25,44.45) 71.37,44.58 76.33,44.58 80.77,40.13 80.77,38.99 82.55,37.21 82.55,33.53 83.94,32.14 Q5.1
RST: length 62
  Top Layer w0.254: 33.99,31.71 R7.2 31.41,34.29 18.64,34.29 16.39,32.04 SW2.3 ; U1.9 58.35,16.66 58.29,16.61 U7.2
  Bottom Layer w0.254: U1.9 55.78,21.87 34.26,21.87 32.59,23.55 32.59,30.38 R7.2
RXD: length 31.7
  Top Layer w0.254: v1(33.33,24.05) 32.39,25 32.39,25.8
  Bottom Layer w0.254: v1(33.33,24.05) 34.91,22.48 57.71,22.48 U1.10
TC00: length 59.3
  Top Layer w0.254: v1(2.79,37.34) 2.67,37.21 2.67,7.44 DC11.2 5.08,5.07 5.08,5.21 8.51,1.78 11.34,1.78 LED2.2
  Bottom Layer w0.254: v1(2.79,37.34) 4.7,39.24 7.11,39.24 14.73,46.86 Q1.2
TC01: length 64.7
  Top Layer w0.254: LED3.2 31.15,2.16 32.39,2.16 33.02,2.79 33.02,4.95 31.75,6.22 25.79,6.22 ; 25.79,6.22 27.94,8.37 27.94,13.08 36.7,21.84 v1(36.7,24.89) ; 25.79,6.22 24.62,5.05 ; v1(36.7,28.45) 36.7,34.29 v1(35.69,35.31)
  Bottom Layer w0.254: Q2.2 32.13,45.6 32.13,38.86 v1(35.69,35.31) ; v1(36.7,24.89) v1(36.7,28.45)
TC02: length 60.8
  Top Layer w0.254: v1(48.89,14.35) 46.74,12.19 46.74,7.75 44.18,5.19 DC33.2 45.22,6.1 50.93,6.1 52.32,4.7 52.32,3.78 LED4.2 ; v1(49.28,25.53) v1(49.28,17.02)
  Bottom Layer w0.254: v1(49.28,25.53) 49.28,29.08 52.07,31.88 52.07,36.2 52.83,36.96 52.83,46.97 Q3.2 ; v1(48.89,14.35) 49.28,14.73 v1(49.28,17.02)
TC03: length 53.5
  Top Layer w0.254: 60.83,8.89 v1(59.94,8.89) 58.67,7.62 58.67,2.89 LED5.2 ; 60.83,8.89 66.17,8.89 67.31,7.75 67.31,6.06 USB44.12 ; 60.83,8.89 60.83,6.08 60.88,6.03 ; v1(52.07,25.53) v1(52.07,17.15)
  Bottom Layer w0.254: v1(52.07,17.15) 52.2,17.15 59.94,9.4 v1(59.94,8.89) ; Q4.2 63.53,25.53 v1(52.07,25.53)
TC04: length 41.5
  Top Layer w0.254: 80.32,8.31 78.23,6.22 78.23,2.89 LED6.2 ; 80.32,8.31 80.32,9.6 ; 80.32,8.31 USB55.1 ; 80.32,9.6 v1(80.26,9.65) ; 80.32,9.6 80.32,9.69 80.57,9.94 85.95,9.94 86.72,9.17 USB55.12
  Bottom Layer w0.254: Q5.2 77.09,23.48 74.8,21.19 74.8,15.11 v1(80.26,9.65)
TXD: length 38.2
  Top Layer w0.254: v1(30.22,24.05) 31.11,24.94 U6.7
  Bottom Layer w0.254: v1(30.22,24.05) 36.11,18.17 62.29,18.17 U1.11
XTAL1: length 86.6
  Top Layer w0.254: v1(70.74,10.03) v1(68.58,10.03) ; U2.2 78.81,14.37 U1.19 83.31,19.3 ; v1(40.51,9.02) v1(44.55,9.02) ; v1(52.58,10.41) 52.96,10.03 v1(60.45,10.03)
  Bottom Layer w0.254: U2.2 71.53,10.82 v1(70.74,10.03) ; v1(44.55,9.02) 45.85,9.02 47.36,10.53 52.46,10.53 v1(52.58,10.41) ; v1(40.51,9.02) 32.48,9.02 30.45,11.05 28.58,11.05 26.54,9.02 23.62,9.02 16.89,15.75 C7.2 ; v1(60.45,10.03) v1(68.58,10.03)
XTAL2: length 76.3
  Top Layer w0.254: v1(54.36,16.89) 54.36,16.76 53.59,16 33.15,16 v1(32.77,15.62) ; U1.18 78.03,16.13 68.45,16.13 66.7,14.37 U2.1 ; C6.2 18.5,25.53 21.59,25.53 v1(21.72,25.65)
  Bottom Layer w0.254: v1(32.77,15.62) 25.91,15.62 22.35,19.18 22.35,25.02 v1(21.72,25.65) ; v1(54.36,16.89) 64.13,16.89 U2.1
$1N2137: length 22.2
  Top Layer w0.254: U6.8 29.85,30.99 27.53,33.31 23.4,33.31 22.41,32.31 22.41,29.38 24.7,27.1 C5.1
$1N11558: length 11.5
  Top Layer w0.254: 85.46,38.86 85.46,39.76 85.09,40.13 78.82,40.13 R8.2
$1N11682: length 25.5
  Top Layer w0.254: LED2.1 9.11,3.97 8,5.08 8,12.95 8.9,13.86 11.95,13.86 13.08,14.99 15.62,14.99 19.3,18.67 19.34,18.67
$1N12284: length 15.3
  Top Layer w0.254: R10.1 28.37,1.48 LED3.1
$1N12327: length 15.1
  Top Layer w0.254: LED4.1 47.93,1.48 R11.1
$1N12370: length 3.9
  Top Layer w0.254: LED5.1 56.72,3.97 R12.1
$1N12592: length 9.1
  Top Layer w0.254: R13.1 77.22,8.72 LED6.1

## Copper pours and planes (outline as drawn; the poured copper is in the pictures)
GND on Top Layer: -3.3,59.82 97.28,59.82 97.28,-5.46 -3.3,-5.46

Small or netless copper shapes (teardrops, artwork), in the pictures only: 225 on Top Layer, 116 on Bottom Layer

## Text on the board
Bottom Silkscreen Layer: By Megre / 2023.10.29
Top Silkscreen Layer: Reset | Power
